# EasyEDA Pro project 4Layer_Artix7_DDR3_Core_Board.epro, schematic Schematic1_1
Board Name: Board1; Create Date: 2025-05-24; Page Name: P1; Project Name: Artix7_DDR_4Layer; Schematic Name: Schematic1; Update Date: 2025-05-24; Company: 嘉立创EDA; Page Size: A4; Version: V1.0
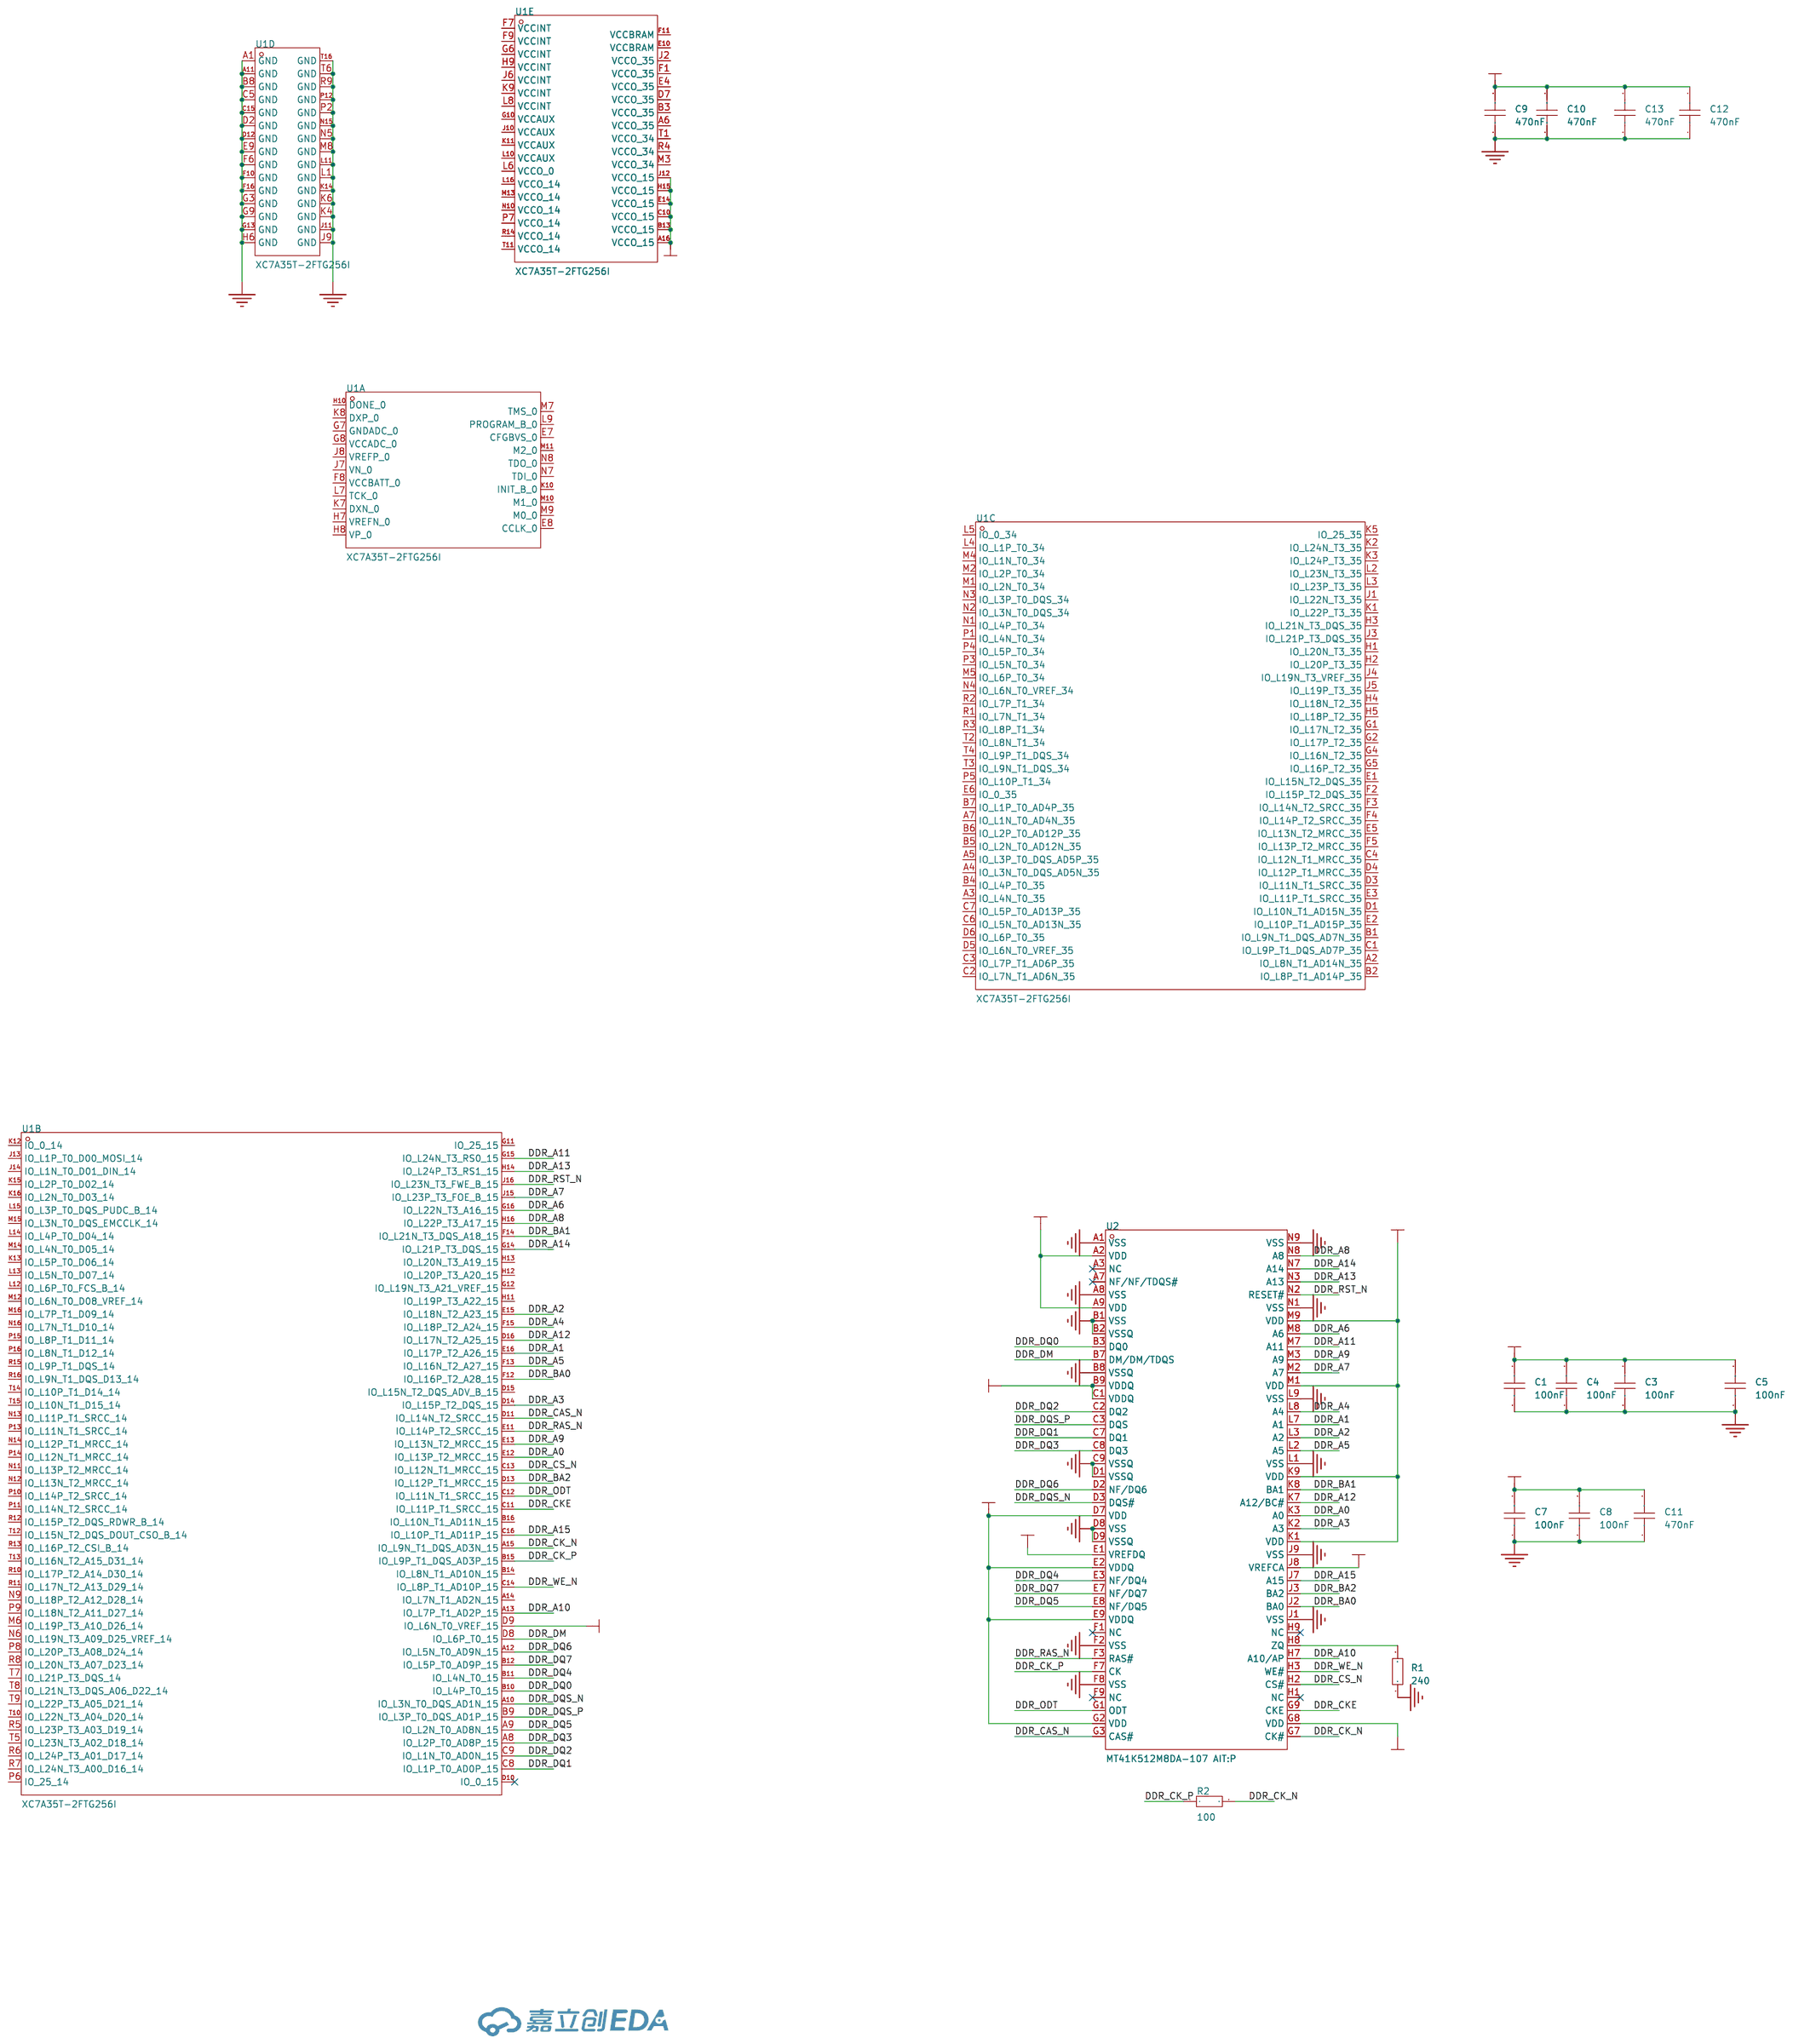
[diagram p1: schematic sheet]

## Parts
C1  100nF  [C0402]
C3  100nF  [C0402]
C4  100nF  [C0402]
C5  100nF  [C0402]
C7  100nF  [C0402]
C8  100nF  [C0402]
C9  470nF  [C0402-S]
C10  470nF  [C0402-S]
C11  470nF  [C0402-S]
C12  470nF  [C0402-S]
C13  470nF  [C0402-S]
R1  240  [R0402]
R2  100  [R0402]
U1  XC7A35T-2FTG256I  [FTBGA-256_L17.0-W17.0-R16-C16-P1.00-TL]  (sections 1,2,3,4,5)
U2  MT41K512M8DA-107 AIT:P  [FBGA-78_L10.5-W8.0-R13-C6-P0.80-TL]

## Library data of the parts
C1 C3-C5 C7-C13 = CAP_0402: Supplier Footprint: 0402
R1 R2 = Res_0402: Supplier Footprint: 0402
U1 = XC7A35T-2FTG256I: LCSC Part Name: XC7A35T 2FTG256I -; Supplier Part: C1521744; Manufacturer: XILINX(赛灵思); Supplier Footprint: FTBGA-256; JLCPCB Part Class: Extended Part; Supplier: LCSC
U2 = MT41K512M8DA-107 AIT:P: 存储器构架(格式):SDRAM DDR3L;时钟频率(fc):-;存储容量:4Gbit;; Supplier Part: C1348756; Manufacturer: micron(镁光); Supplier Footprint: FBGA-78(8x10.5); JLCPCB Part Class: 扩展库; Datasheet: https://atta.szlcsc.com/upload/public/pdf/source/20210823/3BBDCC20C1D6BCF226EC39D08C0A3480.pdf; Supplier: LCSC; Memory Format: SDRAM DDR3L; Memory Size: 4Gbit; Voltage - Supply: 1.28V~1.45V; Current - Supply: 29mA; Refresh Current: 10mA; Operating Temperature: -40℃~+95℃

## Nets
+1V5: C1.2 C3.2 C4.2 C5.2 C9.2 C10.2 C12.2 C13.2 U1.A16(VCCO_15) U1.B13(VCCO_15) U1.C10(VCCO_15) U1.E14(VCCO_15) U1.H15(VCCO_15) U1.J12(VCCO_15) U2.A2(VDD) U2.A9(VDD) U2.B9(VDDQ) U2.C1(VDDQ) U2.D7(VDD) U2.E2(VDDQ) U2.E9(VDDQ) U2.G2(VDD) U2.G8(VDD) U2.K1(VDD) U2.K9(VDD) U2.M1(VDD) U2.M9(VDD)
GND: C1.1 C3.1 C4.1 C5.1 C7.1 C8.1 C9.1 C10.1 C11.1 C12.1 C13.1 R1.1 U1.A1(GND) U1.A11(GND) U1.B8(GND) U1.C5(GND) U1.C15(GND) U1.D2(GND) U1.D12(GND) U1.E9(GND) U1.F6(GND) U1.F10(GND) U1.F16(GND) U1.G3(GND) U1.G9(GND) U1.G13(GND) U1.H6(GND) U1.J9(GND) U1.J11(GND) U1.K4(GND) U1.K6(GND) U1.K14(GND) U1.L1(GND) U1.L11(GND) U1.M8(GND) U1.N5(GND) U1.N15(GND) U1.P2(GND) U1.P12(GND) U1.R9(GND) U1.T6(GND) U1.T16(GND) U2.A1(VSS) U2.A8(VSS) U2.B1(VSS) U2.B2(VSSQ) U2.B8(VSSQ) U2.C9(VSSQ) U2.D1(VSSQ) U2.D8(VSS) U2.D9(VSSQ) U2.F2(VSS) U2.F8(VSS) U2.J1(VSS) U2.J9(VSS) U2.L1(VSS) U2.L9(VSS) U2.N1(VSS) U2.N9(VSS)
DDR_A0: U1.E12(IO_L13P_T2_MRCC_15) U2.K3(A0)
DDR_A1: U1.E16(IO_L17P_T2_A26_15) U2.L7(A1)
DDR_A2: U1.E15(IO_L18N_T2_A23_15) U2.L3(A2)
DDR_A3: U1.D14(IO_L15P_T2_DQS_15) U2.K2(A3)
DDR_A4: U1.F15(IO_L18P_T2_A24_15) U2.L8(A4)
DDR_A5: U1.F13(IO_L16N_T2_A27_15) U2.L2(A5)
DDR_A6: U1.G16(IO_L22N_T3_A16_15) U2.M8(A6)
DDR_A7: U1.J15(IO_L23P_T3_FOE_B_15) U2.M2(A7)
DDR_A8: U1.H16(IO_L22P_T3_A17_15) U2.N8(A8)
DDR_A9: U1.E13(IO_L13N_T2_MRCC_15) U2.M3(A9)
DDR_A10: U1.A13(IO_L7P_T1_AD2P_15) U2.H7(A10/AP)
DDR_A11: U1.G15(IO_L24N_T3_RS0_15) U2.M7(A11)
DDR_A12: U1.D16(IO_L17N_T2_A25_15) U2.K7(A12/BC#)
DDR_A13: U1.H14(IO_L24P_T3_RS1_15) U2.N3(A13)
DDR_A14: U1.G14(IO_L21P_T3_DQS_15) U2.N7(A14)
DDR_A15: U1.C16(IO_L10P_T1_AD11P_15) U2.J7(A15)
DDR_BA0: U1.F12(IO_L16P_T2_A28_15) U2.J2(BA0)
DDR_BA1: U1.F14(IO_L21N_T3_DQS_A18_15) U2.K8(BA1)
DDR_BA2: U1.D13(IO_L12P_T1_MRCC_15) U2.J3(BA2)
DDR_CAS_N: U1.D11(IO_L14N_T2_SRCC_15) U2.G3(CAS#)
DDR_CK_N: R2.2 U1.A15(IO_L9N_T1_DQS_AD3N_15) U2.G7(CK#)
DDR_CK_P: R2.1 U1.B15(IO_L9P_T1_DQS_AD3P_15) U2.F7(CK)
DDR_CKE: U1.C11(IO_L11P_T1_SRCC_15) U2.G9(CKE)
DDR_CS_N: U1.C13(IO_L12N_T1_MRCC_15) U2.H2(CS#)
DDR_DM: U1.D8(IO_L6P_T0_15) U2.B7(DM/DM/TDQS)
DDR_DQ0: U1.B10(IO_L4P_T0_15) U2.B3(DQ0)
DDR_DQ1: U1.C8(IO_L1P_T0_AD0P_15) U2.C7(DQ1)
DDR_DQ2: U1.C9(IO_L1N_T0_AD0N_15) U2.C2(DQ2)
DDR_DQ3: U1.A8(IO_L2P_T0_AD8P_15) U2.C8(DQ3)
DDR_DQ4: U1.B11(IO_L4N_T0_15) U2.E3(NF/DQ4)
DDR_DQ5: U1.A9(IO_L2N_T0_AD8N_15) U2.E8(NF/DQ5)
DDR_DQ6: U1.A12(IO_L5N_T0_AD9N_15) U2.D2(NF/DQ6)
DDR_DQ7: U1.B12(IO_L5P_T0_AD9P_15) U2.E7(NF/DQ7)
DDR_DQS_N: U1.A10(IO_L3N_T0_DQS_AD1N_15) U2.D3(DQS#)
DDR_DQS_P: U1.B9(IO_L3P_T0_DQS_AD1P_15) U2.C3(DQS)
DDR_ODT: U1.C12(IO_L11N_T1_SRCC_15) U2.G1(ODT)
DDR_RAS_N: U1.E11(IO_L14P_T2_SRCC_15) U2.F3(RAS#)
DDR_RST_N: U1.J16(IO_L23N_T3_FWE_B_15) U2.N2(RESET#)
DDR_VREF: C7.2 C8.2 C11.2 U1.D9(IO_L6N_T0_VREF_15) U2.E1(VREFDQ) U2.J8(VREFCA)
DDR_WE_N: U1.C14(IO_L8P_T1_AD10P_15) U2.H3(WE#)
$1N3209: R1.2 U2.H8(ZQ)

Not connected (* = marked no-connect by the designer): U1 A2(IO_L8N_T1_AD14N_35) A3(IO_L4N_T0_35) A4(IO_L3N_T0_DQS_AD5N_35) A5(IO_L3P_T0_DQS_AD5P_35) A6(VCCO_35) A7(IO_L1N_T0_AD4N_35) A14(IO_L7N_T1_AD2N_15) B1(IO_L9N_T1_DQS_AD7N_35) B2(IO_L8P_T1_AD14P_35) B3(VCCO_35) B4(IO_L4P_T0_35) B5(IO_L2N_T0_AD12N_35) B6(IO_L2P_T0_AD12P_35) B7(IO_L1P_T0_AD4P_35) B14(IO_L8N_T1_AD10N_15) B16(IO_L10N_T1_AD11N_15) C1(IO_L9P_T1_DQS_AD7P_35) C2(IO_L7N_T1_AD6N_35) C3(IO_L7P_T1_AD6P_35) C4(IO_L12N_T1_MRCC_35) C6(IO_L5N_T0_AD13N_35) C7(IO_L5P_T0_AD13P_35) D1(IO_L10N_T1_AD15N_35) D3(IO_L11N_T1_SRCC_35) D4(IO_L12P_T1_MRCC_35) D5(IO_L6N_T0_VREF_35) D6(IO_L6P_T0_35) D7(VCCO_35) D10(IO_0_15)* D15(IO_L15N_T2_DQS_ADV_B_15) E1(IO_L15N_T2_DQS_35) E2(IO_L10P_T1_AD15P_35) E3(IO_L11P_T1_SRCC_35) E4(VCCO_35) E5(IO_L13N_T2_MRCC_35) E6(IO_0_35) E7(CFGBVS_0) E8(CCLK_0) E10(VCCBRAM) F1(VCCO_35) F2(IO_L15P_T2_DQS_35) F3(IO_L14N_T2_SRCC_35) F4(IO_L14P_T2_SRCC_35) F5(IO_L13P_T2_MRCC_35) F7(VCCINT) F8(VCCBATT_0) F9(VCCINT) F11(VCCBRAM) G1(IO_L17N_T2_35) G2(IO_L17P_T2_35) G4(IO_L16N_T2_35) G5(IO_L16P_T2_35) G6(VCCINT) G7(GNDADC_0) G8(VCCADC_0) G10(VCCAUX) G11(IO_25_15) G12(IO_L19N_T3_A21_VREF_15) H1(IO_L20N_T3_35) H2(IO_L20P_T3_35) H3(IO_L21N_T3_DQS_35) H4(IO_L18N_T2_35) H5(IO_L18P_T2_35) H7(VREFN_0) H8(VP_0) H9(VCCINT) H10(DONE_0) H11(IO_L19P_T3_A22_15) H12(IO_L20P_T3_A20_15) H13(IO_L20N_T3_A19_15) J1(IO_L22N_T3_35) J2(VCCO_35) J3(IO_L21P_T3_DQS_35) J4(IO_L19N_T3_VREF_35) J5(IO_L19P_T3_35) J6(VCCINT) J7(VN_0) J8(VREFP_0) J10(VCCAUX) J13(IO_L1P_T0_D00_MOSI_14) J14(IO_L1N_T0_D01_DIN_14) K1(IO_L22P_T3_35) K2(IO_L24N_T3_35) K3(IO_L24P_T3_35) K5(IO_25_35) K7(DXN_0) K8(DXP_0) K9(VCCINT) K10(INIT_B_0) K11(VCCAUX) K12(IO_0_14) K13(IO_L5P_T0_D06_14) K15(IO_L2P_T0_D02_14) K16(IO_L2N_T0_D03_14) L2(IO_L23N_T3_35) L3(IO_L23P_T3_35) L4(IO_L1P_T0_34) L5(IO_0_34) L6(VCCO_0) L7(TCK_0) L8(VCCINT) L9(PROGRAM_B_0) L10(VCCAUX) L12(IO_L6P_T0_FCS_B_14) L13(IO_L5N_T0_D07_14) L14(IO_L4P_T0_D04_14) L15(IO_L3P_T0_DQS_PUDC_B_14) L16(VCCO_14) M1(IO_L2N_T0_34) M2(IO_L2P_T0_34) M3(VCCO_34) M4(IO_L1N_T0_34) M5(IO_L6P_T0_34) M6(IO_L19P_T3_A10_D26_14) M7(TMS_0) M9(M0_0) M10(M1_0) M11(M2_0) M12(IO_L6N_T0_D08_VREF_14) M13(VCCO_14) M14(IO_L4N_T0_D05_14) M15(IO_L3N_T0_DQS_EMCCLK_14) M16(IO_L7P_T1_D09_14) N1(IO_L4P_T0_34) N2(IO_L3N_T0_DQS_34) N3(IO_L3P_T0_DQS_34) N4(IO_L6N_T0_VREF_34) N6(IO_L19N_T3_A09_D25_VREF_14) N7(TDI_0) N8(TDO_0) N9(IO_L18P_T2_A12_D28_14) N10(VCCO_14) N11(IO_L13P_T2_MRCC_14) N12(IO_L13N_T2_MRCC_14) N13(IO_L11P_T1_SRCC_14) N14(IO_L12P_T1_MRCC_14) N16(IO_L7N_T1_D10_14) P1(IO_L4N_T0_34) P3(IO_L5N_T0_34) P4(IO_L5P_T0_34) P5(IO_L10P_T1_34) P6(IO_25_14) P7(VCCO_14) P8(IO_L20P_T3_A08_D24_14) P9(IO_L18N_T2_A11_D27_14) P10(IO_L14P_T2_SRCC_14) P11(IO_L14N_T2_SRCC_14) P13(IO_L11N_T1_SRCC_14) P14(IO_L12N_T1_MRCC_14) P15(IO_L8P_T1_D11_14) P16(IO_L8N_T1_D12_14) R1(IO_L7N_T1_34) R2(IO_L7P_T1_34) R3(IO_L8P_T1_34) R4(VCCO_34) R5(IO_L23P_T3_A03_D19_14) R6(IO_L24P_T3_A01_D17_14) R7(IO_L24N_T3_A00_D16_14) R8(IO_L20N_T3_A07_D23_14) R10(IO_L17P_T2_A14_D30_14) R11(IO_L17N_T2_A13_D29_14) R12(IO_L15P_T2_DQS_RDWR_B_14) R13(IO_L16P_T2_CSI_B_14) R14(VCCO_14) R15(IO_L9P_T1_DQS_14) R16(IO_L9N_T1_DQS_D13_14) T1(VCCO_34) T2(IO_L8N_T1_34) T3(IO_L9N_T1_DQS_34) T4(IO_L9P_T1_DQS_34) T5(IO_L23N_T3_A02_D18_14) T7(IO_L21P_T3_DQS_14) T8(IO_L21N_T3_DQS_A06_D22_14) T9(IO_L22P_T3_A05_D21_14) T10(IO_L22N_T3_A04_D20_14) T11(VCCO_14) T12(IO_L15N_T2_DQS_DOUT_CSO_B_14) T13(IO_L16N_T2_A15_D31_14) T14(IO_L10P_T1_D14_14) T15(IO_L10N_T1_D15_14); U2 A3(NC)* A7(NF/NF/TDQS#)* F1(NC)* F9(NC)* H1(NC)* H9(NC)*
